# EAGLE schematic IM-EG2-Top-Board (EAGLE 7.5.0)
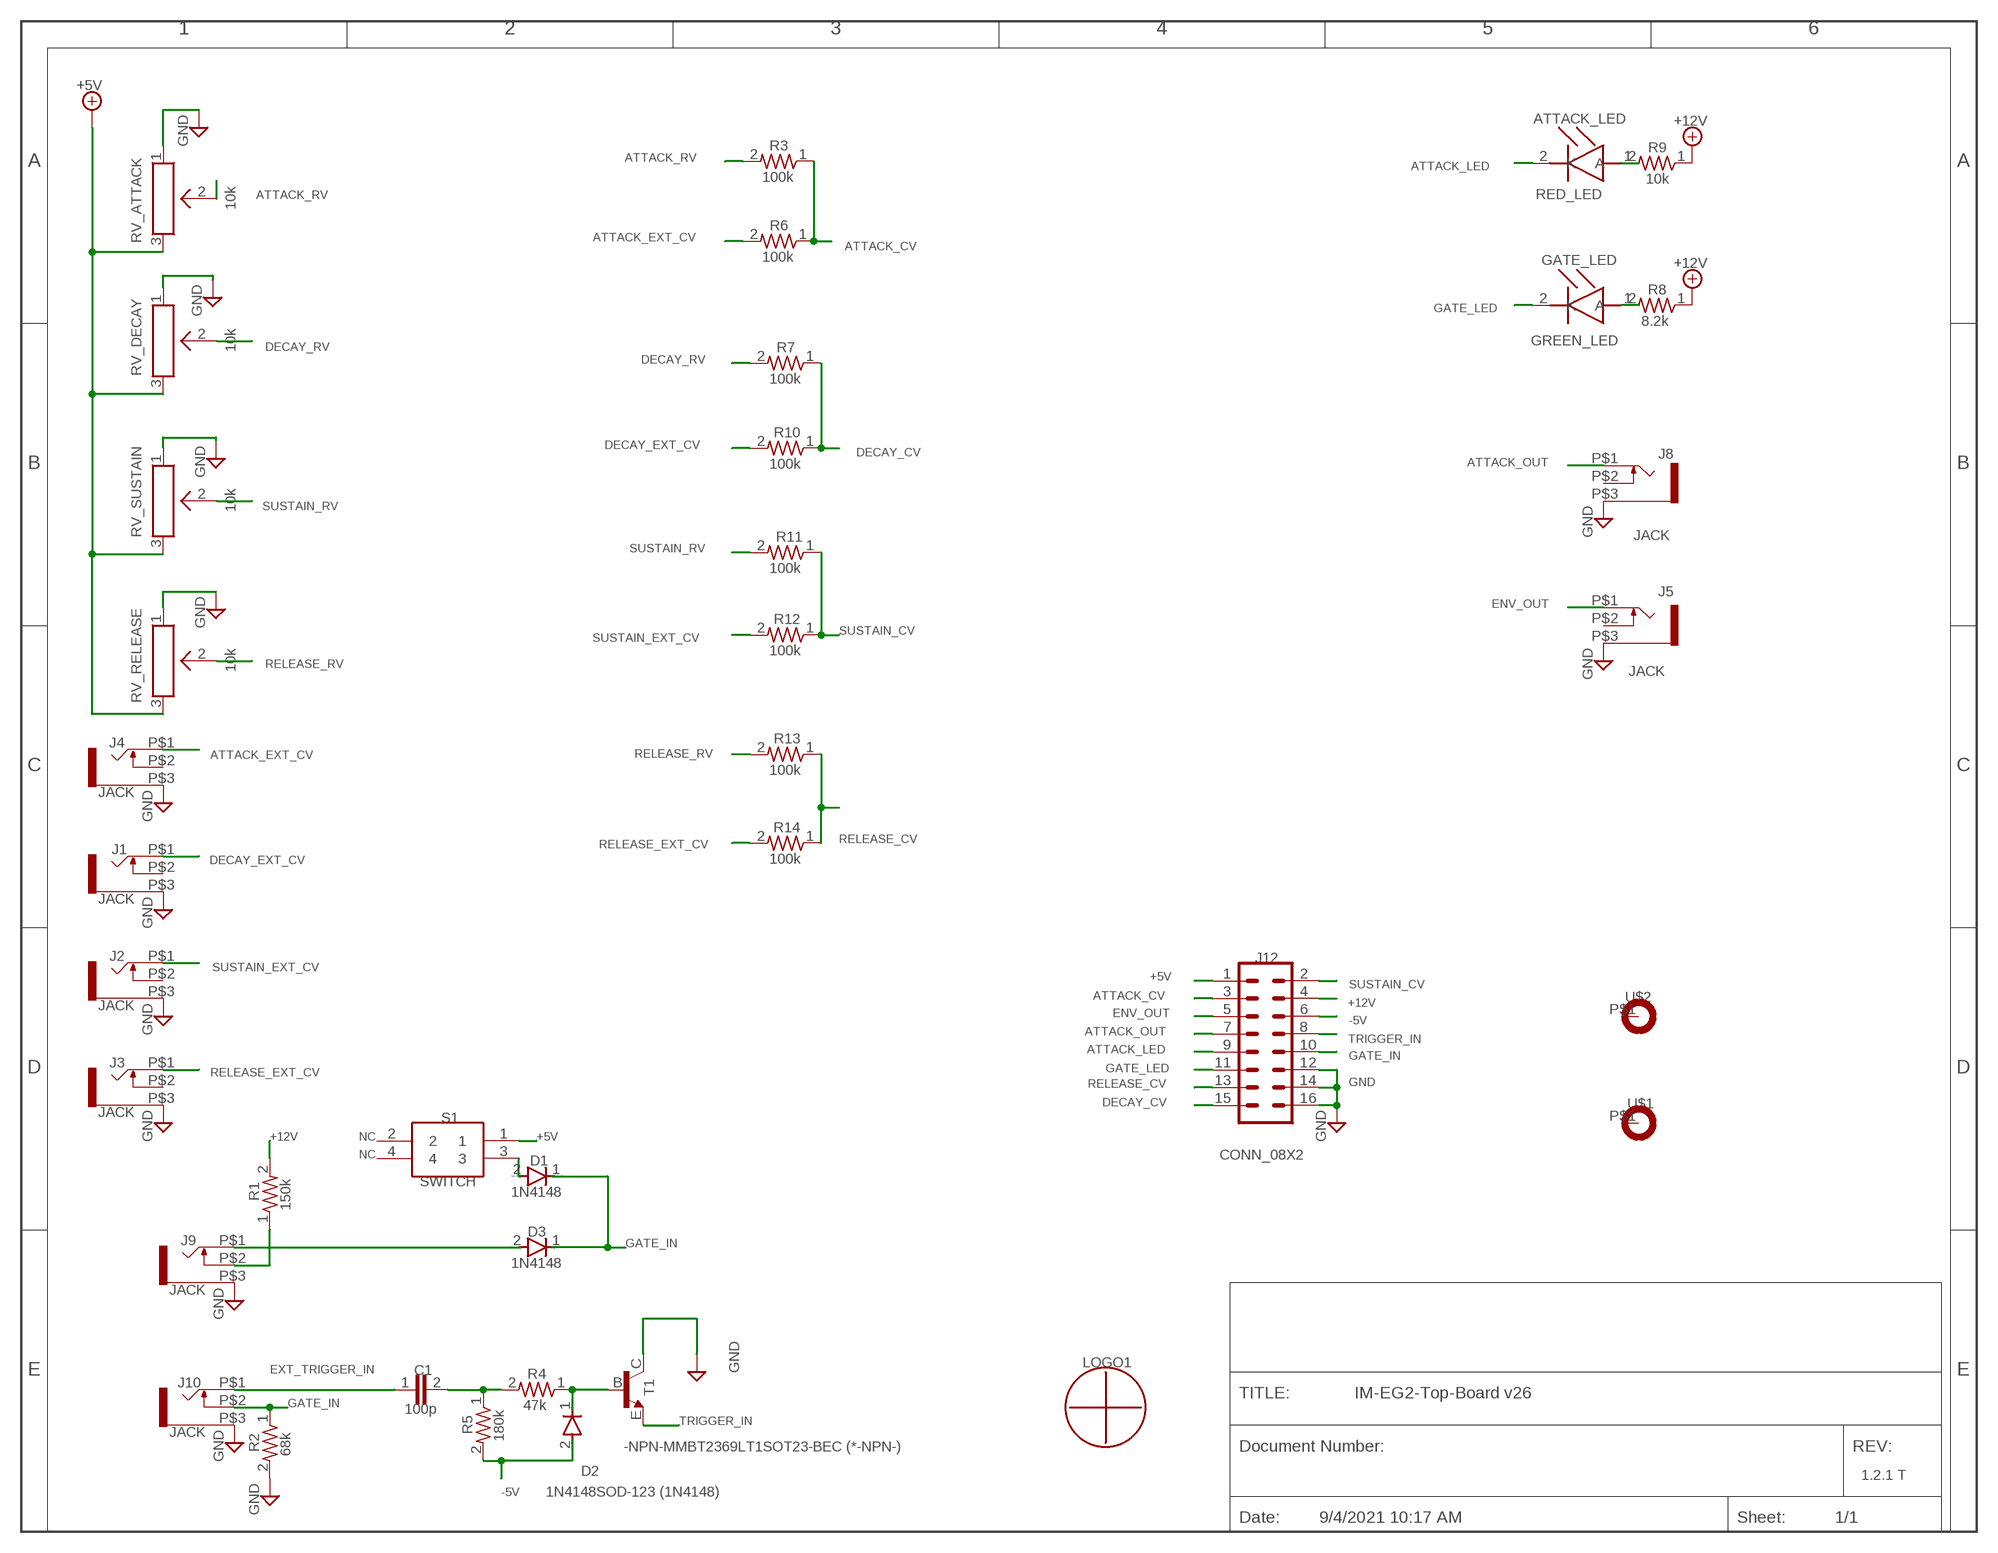
[diagram p0: schematic, sheet 1]

## Parts
ATTACK_LED  RED_LED  TLHG4405TLHG4405-3MM_(TLHG4405)  [LEDRD254W60D320H440B]
C1  100p  C-EUC0805_(C-EU)  [C0805]
D1  1N4148  1N4148SOD-123_(1N4148)  [SOD3715X135]
D2  1N4148SOD-123_(1N4148)  [SOD3715X135]
D3  1N4148  1N4148SOD-123_(1N4148)  [SOD3715X135]
GATE_LED  GREEN_LED  TLHG4405TLHG4405-3MM_(TLHG4405)  [LEDRD254W60D320H440B]
J1  JACK  WQP-PJ301M-12_JACK  [WQP-PJ301M-12_JACK]
J2  JACK  WQP-PJ301M-12_JACK  [WQP-PJ301M-12_JACK]
J3  JACK  WQP-PJ301M-12_JACK  [WQP-PJ301M-12_JACK]
J4  JACK  WQP-PJ301M-12_JACK  [WQP-PJ301M-12_JACK]
J5  JACK  WQP-PJ301M-12_JACK_4  [WQP-PJ301M-12_JACK]
J8  JACK  WQP-PJ301M-12_JACK_4  [WQP-PJ301M-12_JACK]
J9  JACK  WQP-PJ301M-12_JACK  [WQP-PJ301M-12_JACK]
J10  JACK  WQP-PJ301M-12_JACK  [WQP-PJ301M-12_JACK]
J12  CONN_08X2  [2X8]
LOGO1  IM-LOGO-4MM-1M  [IM-LOGO-4MM-1M]
R1  150k  R-US_R0805_(R-US_)  [R0805]
R2  68k  R-US_R0805_(R-US_)  [R0805]
R3  100k  R-US_R0805_(R-US_)  [R0805]
R4  47k  R-US_R0805_(R-US_)  [R0805]
R5  180k  R-US_R0805_(R-US_)  [R0805]
R6  100k  R-US_R0805_(R-US_)  [R0805]
R7  100k  R-US_R0805_(R-US_)  [R0805]
R8  8.2k  R-US_R0805_(R-US_)  [R0805]
R9  10k  R-US_R0805_(R-US_)  [R0805]
R10  100k  R-US_R0805_(R-US_)  [R0805]
R11  100k  R-US_R0805_(R-US_)  [R0805]
R12  100k  R-US_R0805_(R-US_)  [R0805]
R13  100k  R-US_R0805_(R-US_)  [R0805]
R14  100k  R-US_R0805_(R-US_)  [R0805]
RV_ATTACK  10k  ALPHA-RD901F-40-15R  [RD901F4015R1B100K00DL1]
RV_DECAY  10k  ALPHA-RD901F-40-15R  [RD901F4015R1B100K00DL1]
RV_RELEASE  10k  ALPHA-RD901F-40-15R  [RD901F4015R1B100K00DL1]
RV_SUSTAIN  10k  ALPHA-RD901F-40-15R  [RD901F4015R1B100K00DL1]
S1  SWITCH  SKHHDUA010  [SKHHDHA010]
T1  -NPN-MMBT2369LT1SOT23-BEC_(-NPN-)  [SOT23-BEC]
U$1  MOUNT-HOLE-EURORACK3.4-HOLE_(MOUNT-HOLE-EURORACK)  [MOUNT-HOLE-EURORACK]
U$2  MOUNT-HOLE-EURORACK3.4-HOLE_(MOUNT-HOLE-EURORACK)  [MOUNT-HOLE-EURORACK]

## Nets
+5V: J12.1 RV_ATTACK.3 RV_DECAY.3 RV_RELEASE.3 RV_SUSTAIN.3 S1.1
+12V: J12.4 R1.2 R8.1 R9.1
-5V: D2.2(A) J12.6 R5.2
ATTACK_CV: J12.3 R3.1 R6.1
ATTACK_EXT_CV: J4.P$1 R6.2
ATTACK_LED: ATTACK_LED.2(K) J12.9
ATTACK_OUT: J8.P$1 J12.7
ATTACK_RV: R3.2 RV_ATTACK.2
DECAY_CV: J12.15 R7.1 R10.1
DECAY_EXT_CV: J1.P$1 R10.2
DECAY_RV: R7.2 RV_DECAY.2
ENV_OUT: J5.P$1 J12.5
EXT_TRIGGER_IN: C1.1 J10.P$1
GATE_IN: D1.1(C) D3.1(C) J10.P$2 J12.10 R2.1
GATE_LED: GATE_LED.2(K) J12.11
GND: J1.P$3 J2.P$3 J3.P$3 J4.P$3 J5.P$3 J8.P$3 J9.P$3 J10.P$3 J12.12 J12.14 J12.16 R2.2 RV_ATTACK.1 RV_DECAY.1 RV_RELEASE.1 RV_SUSTAIN.1 T1.C
N$1: C1.2 R4.2 R5.1
N$2: D1.2(A) S1.3
N$3: D3.2(A) J9.P$1
N$4: J9.P$2 R1.1
N$5: GATE_LED.1(A) R8.2
N$6: D2.1(C) R4.1 T1.B
N$7: ATTACK_LED.1(A) R9.2
RELEASE_CV: J12.13 R13.1 R14.1
RELEASE_EXT_CV: J3.P$1 R14.2
RELEASE_RV: R13.2 RV_RELEASE.2
SUSTAIN_CV: J12.2 R11.1 R12.1
SUSTAIN_EXT_CV: J2.P$1 R12.2
SUSTAIN_RV: R11.2 RV_SUSTAIN.2
TRIGGER_IN: J12.8 T1.E
Unconnected: J1.P$2 J2.P$2 J3.P$2 J4.P$2 J5.P$2 J8.P$2 S1.2 S1.4 U$1.P$1(MOUNT) U$2.P$1(MOUNT)

## Notes on the sheet
- 1 | 2 | 3 | 4 | 5 | 6
- +5V
- ATTACK_LED | +12V
- GND
- A | ATTACK_RV | R3 | R9 | A
- 100k | ATTACK_LED | 10k
- RED_LED
- ATTACK_RV
- 10k
- ATTACK_EXT_CV | R6
- RV_ATTACK
- 100k | ATTACK_CV
- GATE_LED | +12V
- R8
- GATE_LED
- GND | 8.2k
- GREEN_LED
- 10k | DECAY_RV | R7
- DECAY_RV
- RV_DECAY | 100k
- DECAY_EXT_CV | R10
- B | 100k | DECAY_CV | ATTACK_OUT | J8 | B
- GND
- 10k | SUSTAIN_RV
- JACK
- RV_SUSTAIN | GND
- SUSTAIN_RV | R11
- 100k
- ENV_OUT | J5
- GND | R12
- SUSTAIN_CV
- SUSTAIN_EXT_CV | 100k
- RELEASE_RV | JACK
- 10k
- GND
- RV_RELEASE
- R13
- J4
- C | ATTACK_EXT_CV | RELEASE_RV | C
- 100k
- JACK
- GND
- R14
- RELEASE_CV
- RELEASE_EXT_CV
- J1 | 100k
- DECAY_EXT_CV
- JACK
- GND
- J2 | J12
- SUSTAIN_EXT_CV | +5V
- ATTACK_CV | SUSTAIN_CV
- JACK | U$2
- ENV_OUT | +12V
- ATTACK_OUT | -5V
- GND
- ATTACK_LED | TRIGGER_IN
- D | GATE_IN | D
- GATE_LED
- J3
- RELEASE_EXT_CV | RELEASE_CV
- GND
- DECAY_CV
- JACK | U$1
- S1
- GND | +12V | NC | +5V | GND
- CONN_08X2
- NC
- D1
- SWITCH | SpiceOrder 1 | SpiceOrder 2
- 1N4148
- R1
- 150k
- D3
- J9
- SpiceOrder 1 | SpiceOrder 2 | GATE_IN
- 1N4148
- JACK
- GND
- E | E
- LOGO1
- EXT_TRIGGER_IN | C1 | GND
- R4
- J10
- 47k | T1 | TITLE: | IM-EG2-Top-Board v26
- 100p
- GATE_IN | SpiceOrder 2
- JACK | TRIGGER_IN
- R5
- 180k
- SpiceOrder 1
- R2 | -NPN-MMBT2369LT1SOT23-BEC (*-NPN-) | Document Number: | REV:
- 68k
- GND
- D2 | 1.2.1 T
- 1N4148SOD-123 (1N4148)
- -5V
- GND
- Date: | 9/4/2021 10:17 AM | Sheet: | 1/1

## Library data of the parts
ATTACK_LED = common:TLHG4405TLHG4405-3MM_(TLHG4405); VALUE: GREEN_LED
C1 = common:C-EUC0805_(C-EU); SPICEPREFIX: C
D1 D3 = common:1N4148SOD-123_(1N4148)
D2 = common:1N4148SOD-123_(1N4148); VALUE: 1N4148
GATE_LED = common:TLHG4405TLHG4405-3MM_(TLHG4405)
J1-J4 J9 J10 = common:WQP-PJ301M-12_JACK
J5 J8 = common:WQP-PJ301M-12_JACK_4
J12 = common:CONN_08X2
LOGO1 = common:IM-LOGO-4MM-1M
R1 = common:R-US_R0805_(R-US_); SPICEPREFIX: R
R2-R14 = common:R-US_R0805_(R-US_); SPICEPREFIX: R; VALUE: 150k
RV_ATTACK RV_DECAY RV_RELEASE RV_SUSTAIN = common:ALPHA-RD901F-40-15R; DESCRIPTION: Potentiometers 9mm Linear 100K Round Shaft; HEIGHT: 25mm; MANUFACTURER_NAME: Alpha (Taiwan); MANUFACTURER_PART_NUMBER: RD901F-40-15R1-B100K-00DL1; MOUSER_PART_NUMBER: 311-1940F-15R1-B100K; MOUSER_PRICE-STOCK: https://www.mouser.com/Search/Refine.aspx?Keyword=311-1940F-15R1-B100K
S1 = common:SKHHDUA010; DESCRIPTION: Grey Stem Tactile Switch, SPST-NO 50 mA 13mm; HEIGHT: 17.2mm; MANUFACTURER_NAME: ALPS; MANUFACTURER_PART_NUMBER: SKHHDUA010; MOUSER_PART_NUMBER: 688-SKHHDU; MOUSER_PRICE-STOCK: https://www.mouser.com/Search/Refine.aspx?Keyword=688-SKHHDU
T1 = common:-NPN-MMBT2369LT1SOT23-BEC_(*-NPN-)
U$1 U$2 = common:MOUNT-HOLE-EURORACK3.4-HOLE_(MOUNT-HOLE-EURORACK)